# Altium schematic sheet ADC-TopSheet.SchDoc: <SPECIFIC SHEET FUNCTION>
size A3; Date: DO NOT USE, RATHER USE PROJ OPTIONS; DrawnBy: DO NOT USE, RATHER USE PROJ OPTIONS; Engineer: DO NOT USE, RATHER USE PROJ OPTIONS; Organization: DO NOT USE, RATHER USE PROJ OPTIONS; DocumentNumber: 1; Revision: DO NOT USE, RATHER USE PROJ OPTIONS; SheetNumber: 1; SheetTotal: 12; SCH_Sheet_Filename: <Filename.SchDoc>; CurrentTime: DO NOT USE, RATHER USE PROJ OPTIONS; Time: DO NOT USE, RATHER USE PROJ OPTIONS; DocumentFullPathAndName: DO NOT USE, RATHER USE PROJ OPTIONS; DocumentName: DO NOT USE, RATHER USE PROJ OPTIONS; ModifiedDate: DO NOT USE, RATHER USE PROJ OPTIONS; ImagePath: DO NOT USE, RATHER USE PROJ OPTIONS
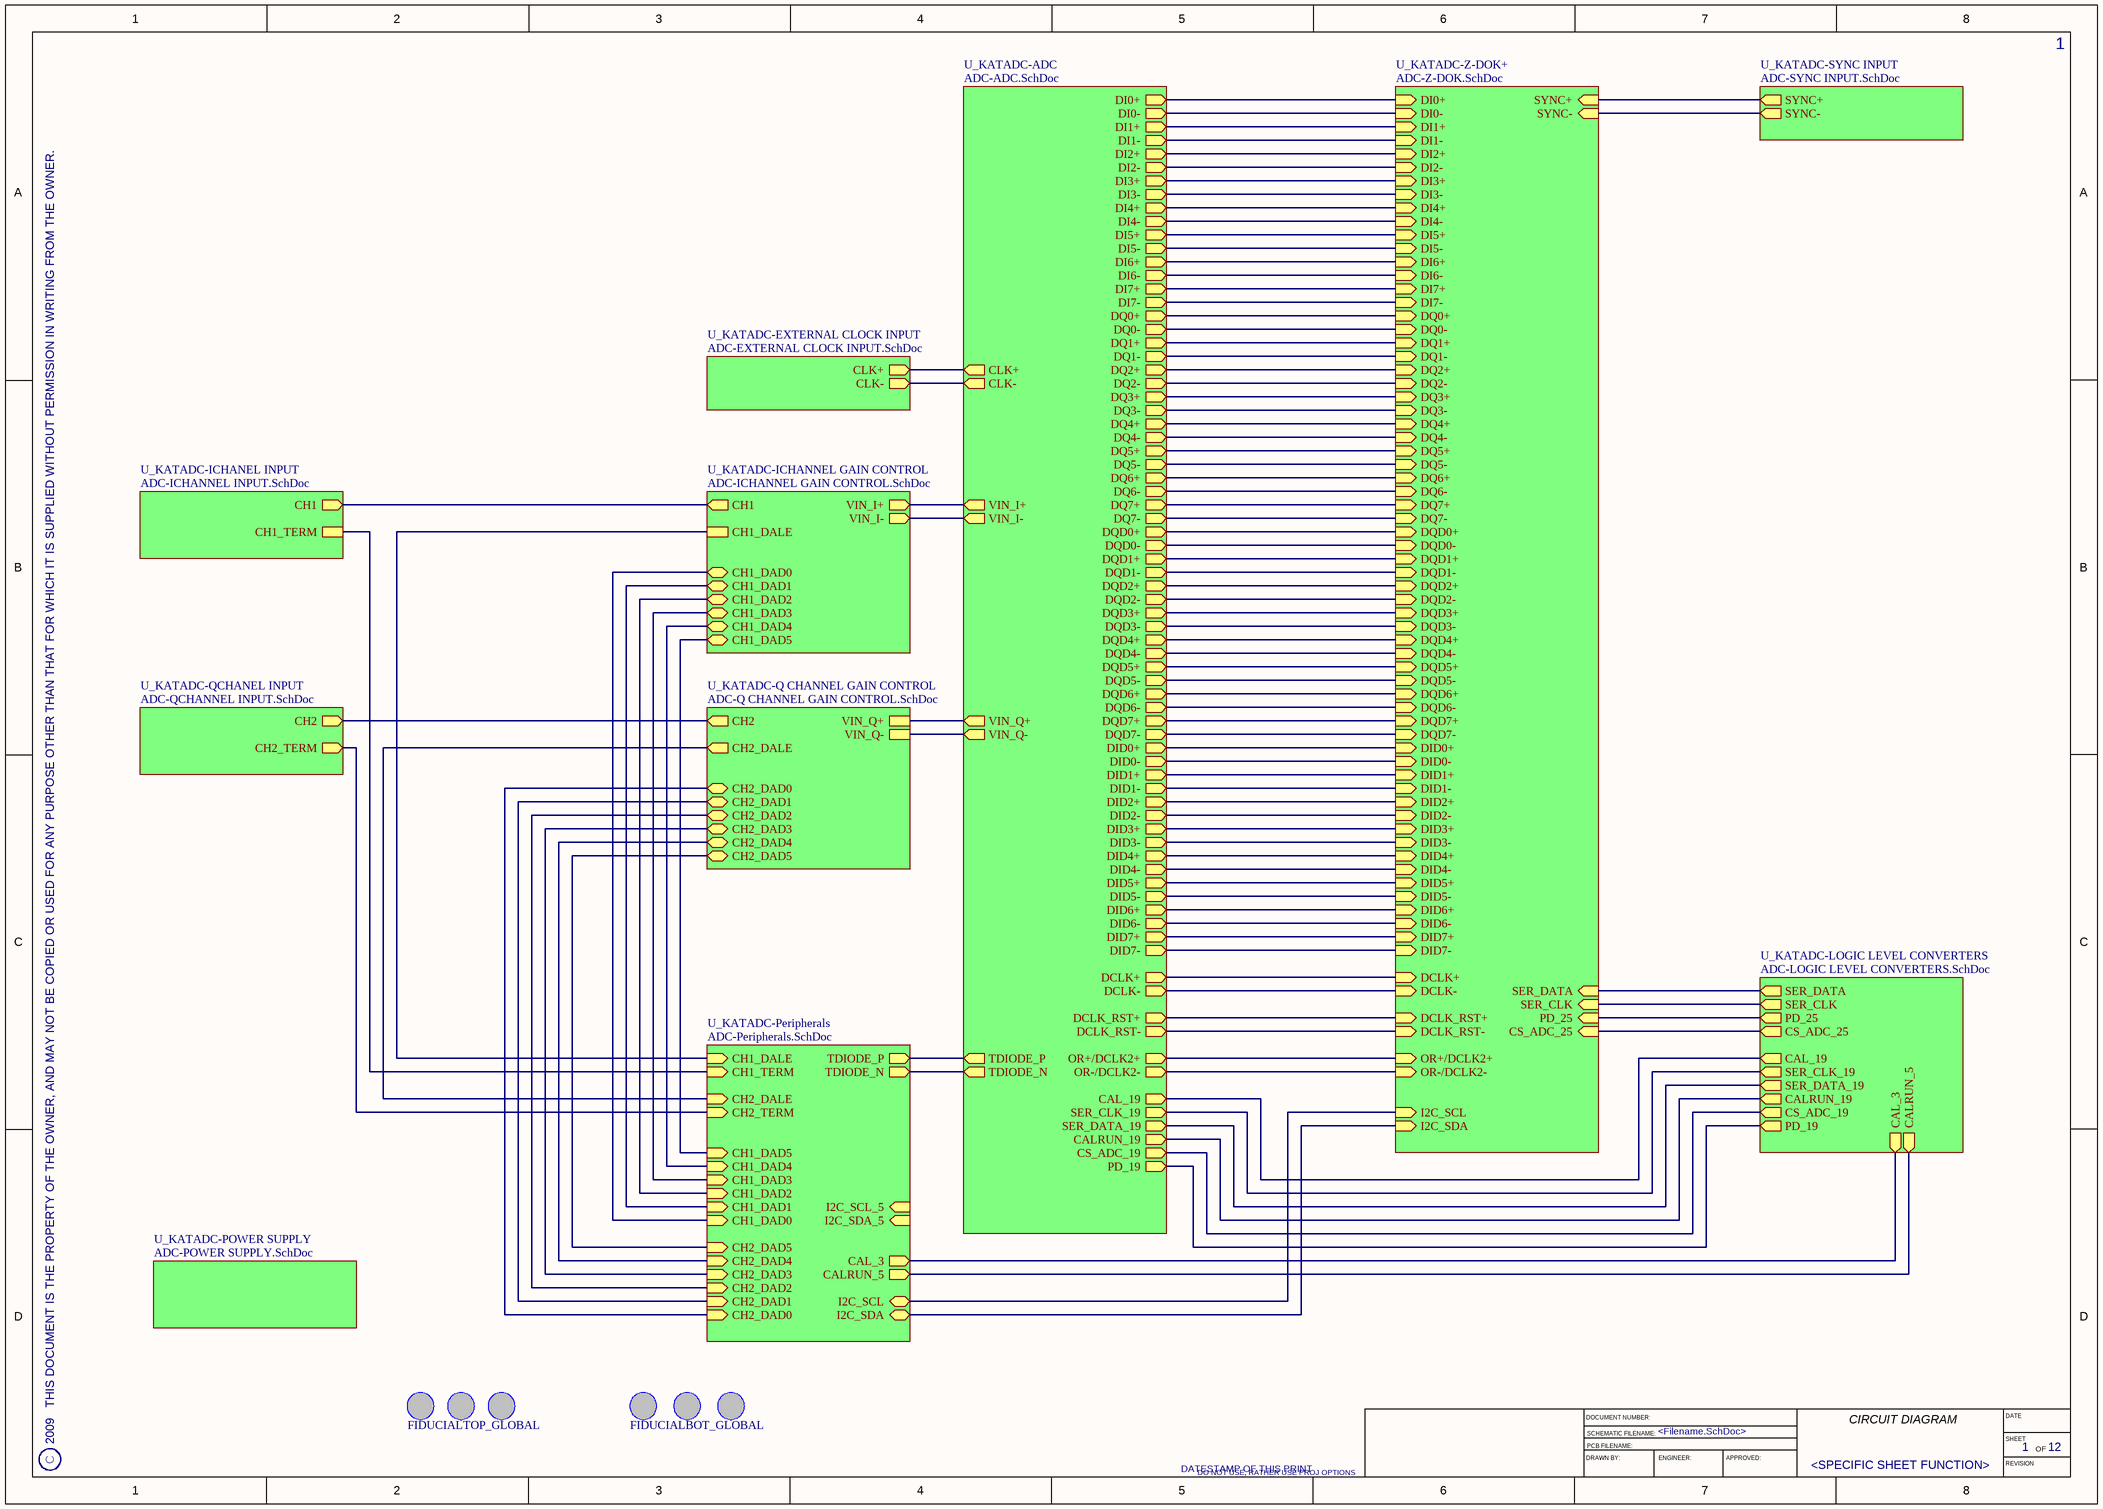
[diagram p0: ADC-TopSheet.SchDoc]

## Parts
F1  FIDUCIALTOP_GLOBAL  [FiducialTop_Global]
F2  FIDUCIALTOP_GLOBAL  [FiducialTop_Global]  (value not drawn)
F3  FIDUCIALTOP_GLOBAL  [FiducialTop_Global]  (value not drawn)
F6  FIDUCIALBOT_GLOBAL  [FiducialBot_Global]
F7  FIDUCIALBOT_GLOBAL  [FiducialBot_Global]  (value not drawn)
F8  FIDUCIALBOT_GLOBAL  [FiducialBot_Global]  (value not drawn)

## Sub-sheets
U_KATADC-ADC = ADC-ADC.SchDoc: DI0+ (out), DI0- (out), DI1+ (out), DI1- (out), DI2+ (out), DI2- (out), DI3+ (out), DI3- (out), DI4+ (out), DI4- (out), DI5+ (out), DI5- (out), DI6+ (out), DI6- (out), DI7+ (out), DI7- (out), DQ0+ (out), DQ0- (out), DQ1+ (out), DQ1- (out), DQ2+ (out), DQ2- (out), DQ3+ (out), DQ3- (out), DQ4+ (out), DQ4- (out), DQ5+ (out), DQ5- (out), DQ6+ (out), DQ6- (out), DQ7+ (out), DQ7- (out), DQD0+ (out), DQD0- (out), DQD1+ (out), DQD1- (out), DQD2+ (out), DQD2- (out), DQD3+ (out), DQD3- (out), DQD4+ (out), DQD4- (out), DQD5+ (out), DQD5- (out), DQD6+ (out), DQD6- (out), DQD7+ (out), DQD7- (out), DID0+ (out), DID0- (out), DID1+ (out), DID1- (out), DID2+ (out), DID2- (out), DID3+ (out), DID3- (out), DID4+ (out), DID4- (out), DID5+ (out), DID5- (out), DID6+ (out), DID6- (out), DID7+ (out), DID7- (out), TDIODE_P (out), TDIODE_N (out), VIN_I+ (out), VIN_I- (out), VIN_Q+ (out), VIN_Q- (out), PD_19 (out), DCLK_RST- (out), SER_CLK_19 (out), CLK+ (out), CLK- (out), SER_DATA_19 (out), DCLK_RST+ (out), CAL_19 (out), CS_ADC_19 (out), CALRUN_19 (out), OR+/DCLK2+ (out), OR-/DCLK2- (out), DCLK+ (out), DCLK- (out)
U_KATADC-EXTERNAL CLOCK INPUT = ADC-EXTERNAL CLOCK INPUT.SchDoc: CLK+ (out), CLK- (out)
U_KATADC-ICHANEL INPUT = ADC-ICHANNEL INPUT.SchDoc: CH1 (out), CH1_TERM
U_KATADC-ICHANNEL GAIN CONTROL = ADC-ICHANNEL GAIN CONTROL.SchDoc: VIN_I+ (out), VIN_I- (out), CH1 (out), CH1_DALE, CH1_DAD0, CH1_DAD1, CH1_DAD2, CH1_DAD3, CH1_DAD4, CH1_DAD5
U_KATADC-LOGIC LEVEL CONVERTERS = ADC-LOGIC LEVEL CONVERTERS.SchDoc: SER_DATA (out), SER_CLK (out), SER_DATA_19 (out), SER_CLK_19 (out), CALRUN_19 (out), CALRUN_5 (out), CAL_3 (out), CAL_19 (out), CS_ADC_25 (out), PD_25 (out), CS_ADC_19 (out), PD_19 (out)
U_KATADC-Peripherals = ADC-Peripherals.SchDoc: I2C_SDA_5 (in), I2C_SCL_5 (in), CH2_DAD0 (in), CH2_DAD1 (in), CH2_DAD2 (in), CH2_DAD3 (in), CH2_DAD4 (in), CH2_DAD5 (in), CH2_DALE (in), CH2_TERM (in), CAL_3 (out), CH1_DAD0 (in), CH1_DAD1 (in), CH1_DAD2 (in), CH1_DAD3 (in), CH1_DAD4 (in), CH1_DAD5 (in), CH1_DALE (in), CH1_TERM (in), CALRUN_5 (out), TDIODE_P (out), TDIODE_N (out), I2C_SDA, I2C_SCL
U_KATADC-POWER SUPPLY = ADC-POWER SUPPLY.SchDoc: no entries
U_KATADC-Q CHANNEL GAIN CONTROL = ADC-Q CHANNEL GAIN CONTROL.SchDoc: VIN_Q+, VIN_Q-, CH2 (out), CH2_DALE (out), CH2_DAD0, CH2_DAD1, CH2_DAD2, CH2_DAD3, CH2_DAD4, CH2_DAD5
U_KATADC-QCHANEL INPUT = ADC-QCHANNEL INPUT.SchDoc: CH2 (out), CH2_TERM (out)
U_KATADC-SYNC INPUT = ADC-SYNC INPUT.SchDoc: SYNC+ (out), SYNC- (out)
U_KATADC-Z-DOK+ = ADC-Z-DOK.SchDoc: SER_CLK (in), DID1+ (in), DID1- (in), DID4+ (in), DI0+ (in), DI0- (in), DI4- (in), DCLK_RST+ (in), DCLK_RST- (in), DQ4+ (in), DQ4- (in), DQ0+ (in), DI4+ (in), DQ0- (in), DQD4+ (in), DQD4- (in), DQD0+ (in), DQD0- (in), DID4- (in), SER_DATA (in), DID0+ (in), DID0- (in), DID3+ (in), DID7+ (in), DID7- (in), DI3- (in), DI7+ (in), DI7- (in), DQ5+ (in), DQ5- (in), DQ1+ (in), DI3+ (in), DQ1- (in), DQD5+ (in), DQD5- (in), DQD1+ (in), DQD1- (in), DID3- (in), I2C_SDA (in), OR-/DCLK2- (in), OR+/DCLK2+ (in), DQD3- (in), DQD3+ (in), DQD7- (in), DQD7+ (in), DQ3- (in), CS_ADC_25 (in), I2C_SCL (in), SYNC+ (in), SYNC- (in), DID5+ (in), DID5- (in), DI1+ (in), DI1- (in), DI5+ (in), DI5- (in), DQ7+ (in), DQ7- (in), DQ3+ (in), DCLK- (in), DCLK+ (in), DQD2- (in), DQD2+ (in), DQD6- (in), DQD6+ (in), DQ2- (in), PD_25 (in), DID2+ (in), DID2- (in), DID6+ (in), DID6- (in), DI2+ (in), DI2- (in), DI6+ (in), DI6- (in), DQ6+ (in), DQ6- (in), DQ2+ (in)

## Nets
(unnamed): sheet U_KATADC-EXTERNAL CLOCK INPUT/CLK+, sheet U_KATADC-ADC/CLK+
(unnamed): sheet U_KATADC-EXTERNAL CLOCK INPUT/CLK-, sheet U_KATADC-ADC/CLK-
(unnamed): sheet U_KATADC-ICHANEL INPUT/CH1, sheet U_KATADC-ICHANNEL GAIN CONTROL/CH1
(unnamed): sheet U_KATADC-ICHANEL INPUT/CH1_TERM, sheet U_KATADC-Peripherals/CH1_TERM
(unnamed): sheet U_KATADC-ICHANNEL GAIN CONTROL/VIN_I+, sheet U_KATADC-ADC/VIN_I+
(unnamed): sheet U_KATADC-ICHANNEL GAIN CONTROL/VIN_I-, sheet U_KATADC-ADC/VIN_I-
(unnamed): sheet U_KATADC-ICHANNEL GAIN CONTROL/CH1_DALE, sheet U_KATADC-Peripherals/CH1_DALE
(unnamed): sheet U_KATADC-ICHANNEL GAIN CONTROL/CH1_DAD0, sheet U_KATADC-Peripherals/CH1_DAD0
(unnamed): sheet U_KATADC-ICHANNEL GAIN CONTROL/CH1_DAD1, sheet U_KATADC-Peripherals/CH1_DAD1
(unnamed): sheet U_KATADC-ICHANNEL GAIN CONTROL/CH1_DAD2, sheet U_KATADC-Peripherals/CH1_DAD2
(unnamed): sheet U_KATADC-ICHANNEL GAIN CONTROL/CH1_DAD3, sheet U_KATADC-Peripherals/CH1_DAD3
(unnamed): sheet U_KATADC-ICHANNEL GAIN CONTROL/CH1_DAD4, sheet U_KATADC-Peripherals/CH1_DAD4
(unnamed): sheet U_KATADC-ICHANNEL GAIN CONTROL/CH1_DAD5, sheet U_KATADC-Peripherals/CH1_DAD5
(unnamed): sheet U_KATADC-LOGIC LEVEL CONVERTERS/SER_DATA, sheet U_KATADC-Z-DOK+/SER_DATA
(unnamed): sheet U_KATADC-LOGIC LEVEL CONVERTERS/SER_CLK, sheet U_KATADC-Z-DOK+/SER_CLK
(unnamed): sheet U_KATADC-LOGIC LEVEL CONVERTERS/SER_DATA_19, sheet U_KATADC-ADC/SER_DATA_19
(unnamed): sheet U_KATADC-LOGIC LEVEL CONVERTERS/SER_CLK_19, sheet U_KATADC-ADC/SER_CLK_19
(unnamed): sheet U_KATADC-LOGIC LEVEL CONVERTERS/CALRUN_19, sheet U_KATADC-ADC/CALRUN_19
(unnamed): sheet U_KATADC-LOGIC LEVEL CONVERTERS/CALRUN_5, sheet U_KATADC-Peripherals/CALRUN_5
(unnamed): sheet U_KATADC-LOGIC LEVEL CONVERTERS/CAL_3, sheet U_KATADC-Peripherals/CAL_3
(unnamed): sheet U_KATADC-LOGIC LEVEL CONVERTERS/CAL_19, sheet U_KATADC-ADC/CAL_19
(unnamed): sheet U_KATADC-LOGIC LEVEL CONVERTERS/CS_ADC_25, sheet U_KATADC-Z-DOK+/CS_ADC_25
(unnamed): sheet U_KATADC-LOGIC LEVEL CONVERTERS/PD_25, sheet U_KATADC-Z-DOK+/PD_25
(unnamed): sheet U_KATADC-LOGIC LEVEL CONVERTERS/CS_ADC_19, sheet U_KATADC-ADC/CS_ADC_19
(unnamed): sheet U_KATADC-LOGIC LEVEL CONVERTERS/PD_19, sheet U_KATADC-ADC/PD_19
(unnamed): sheet U_KATADC-Peripherals/CH2_DAD0, sheet U_KATADC-Q CHANNEL GAIN CONTROL/CH2_DAD0
(unnamed): sheet U_KATADC-Peripherals/CH2_DAD1, sheet U_KATADC-Q CHANNEL GAIN CONTROL/CH2_DAD1
(unnamed): sheet U_KATADC-Peripherals/CH2_DAD2, sheet U_KATADC-Q CHANNEL GAIN CONTROL/CH2_DAD2
(unnamed): sheet U_KATADC-Peripherals/CH2_DAD3, sheet U_KATADC-Q CHANNEL GAIN CONTROL/CH2_DAD3
(unnamed): sheet U_KATADC-Peripherals/CH2_DAD4, sheet U_KATADC-Q CHANNEL GAIN CONTROL/CH2_DAD4
(unnamed): sheet U_KATADC-Peripherals/CH2_DAD5, sheet U_KATADC-Q CHANNEL GAIN CONTROL/CH2_DAD5
(unnamed): sheet U_KATADC-Peripherals/CH2_DALE, sheet U_KATADC-Q CHANNEL GAIN CONTROL/CH2_DALE
(unnamed): sheet U_KATADC-Peripherals/CH2_TERM, sheet U_KATADC-QCHANEL INPUT/CH2_TERM
(unnamed): sheet U_KATADC-Peripherals/TDIODE_P, sheet U_KATADC-ADC/TDIODE_P
(unnamed): sheet U_KATADC-Peripherals/TDIODE_N, sheet U_KATADC-ADC/TDIODE_N
(unnamed): sheet U_KATADC-Peripherals/I2C_SDA, sheet U_KATADC-Z-DOK+/I2C_SDA
(unnamed): sheet U_KATADC-Peripherals/I2C_SCL, sheet U_KATADC-Z-DOK+/I2C_SCL
(unnamed): sheet U_KATADC-QCHANEL INPUT/CH2, sheet U_KATADC-Q CHANNEL GAIN CONTROL/CH2
(unnamed): sheet U_KATADC-Q CHANNEL GAIN CONTROL/VIN_Q+, sheet U_KATADC-ADC/VIN_Q+
(unnamed): sheet U_KATADC-Q CHANNEL GAIN CONTROL/VIN_Q-, sheet U_KATADC-ADC/VIN_Q-
(unnamed): sheet U_KATADC-SYNC INPUT/SYNC+, sheet U_KATADC-Z-DOK+/SYNC+
(unnamed): sheet U_KATADC-SYNC INPUT/SYNC-, sheet U_KATADC-Z-DOK+/SYNC-
(unnamed): sheet U_KATADC-Z-DOK+/DID1+, sheet U_KATADC-ADC/DID1+
(unnamed): sheet U_KATADC-Z-DOK+/DID1-, sheet U_KATADC-ADC/DID1-
(unnamed): sheet U_KATADC-Z-DOK+/DID4+, sheet U_KATADC-ADC/DID4+
(unnamed): sheet U_KATADC-Z-DOK+/DI0+, sheet U_KATADC-ADC/DI0+
(unnamed): sheet U_KATADC-Z-DOK+/DI0-, sheet U_KATADC-ADC/DI0-
(unnamed): sheet U_KATADC-Z-DOK+/DI4-, sheet U_KATADC-ADC/DI4-
(unnamed): sheet U_KATADC-Z-DOK+/DCLK_RST+, sheet U_KATADC-ADC/DCLK_RST+
(unnamed): sheet U_KATADC-Z-DOK+/DCLK_RST-, sheet U_KATADC-ADC/DCLK_RST-
(unnamed): sheet U_KATADC-Z-DOK+/DQ4+, sheet U_KATADC-ADC/DQ4+
(unnamed): sheet U_KATADC-Z-DOK+/DQ4-, sheet U_KATADC-ADC/DQ4-
(unnamed): sheet U_KATADC-Z-DOK+/DQ0+, sheet U_KATADC-ADC/DQ0+
(unnamed): sheet U_KATADC-Z-DOK+/DI4+, sheet U_KATADC-ADC/DI4+
(unnamed): sheet U_KATADC-Z-DOK+/DQ0-, sheet U_KATADC-ADC/DQ0-
(unnamed): sheet U_KATADC-Z-DOK+/DQD4+, sheet U_KATADC-ADC/DQD4+
(unnamed): sheet U_KATADC-Z-DOK+/DQD4-, sheet U_KATADC-ADC/DQD4-
(unnamed): sheet U_KATADC-Z-DOK+/DQD0+, sheet U_KATADC-ADC/DQD0+
(unnamed): sheet U_KATADC-Z-DOK+/DQD0-, sheet U_KATADC-ADC/DQD0-
(unnamed): sheet U_KATADC-Z-DOK+/DID4-, sheet U_KATADC-ADC/DID4-
(unnamed): sheet U_KATADC-Z-DOK+/DID0+, sheet U_KATADC-ADC/DID0+
(unnamed): sheet U_KATADC-Z-DOK+/DID0-, sheet U_KATADC-ADC/DID0-
(unnamed): sheet U_KATADC-Z-DOK+/DID3+, sheet U_KATADC-ADC/DID3+
(unnamed): sheet U_KATADC-Z-DOK+/DID7+, sheet U_KATADC-ADC/DID7+
(unnamed): sheet U_KATADC-Z-DOK+/DID7-, sheet U_KATADC-ADC/DID7-
(unnamed): sheet U_KATADC-Z-DOK+/DI3-, sheet U_KATADC-ADC/DI3-
(unnamed): sheet U_KATADC-Z-DOK+/DI7+, sheet U_KATADC-ADC/DI7+
(unnamed): sheet U_KATADC-Z-DOK+/DI7-, sheet U_KATADC-ADC/DI7-
(unnamed): sheet U_KATADC-Z-DOK+/DQ5+, sheet U_KATADC-ADC/DQ5+
(unnamed): sheet U_KATADC-Z-DOK+/DQ5-, sheet U_KATADC-ADC/DQ5-
(unnamed): sheet U_KATADC-Z-DOK+/DQ1+, sheet U_KATADC-ADC/DQ1+
(unnamed): sheet U_KATADC-Z-DOK+/DI3+, sheet U_KATADC-ADC/DI3+
(unnamed): sheet U_KATADC-Z-DOK+/DQ1-, sheet U_KATADC-ADC/DQ1-
(unnamed): sheet U_KATADC-Z-DOK+/DQD5+, sheet U_KATADC-ADC/DQD5+
(unnamed): sheet U_KATADC-Z-DOK+/DQD5-, sheet U_KATADC-ADC/DQD5-
(unnamed): sheet U_KATADC-Z-DOK+/DQD1+, sheet U_KATADC-ADC/DQD1+
(unnamed): sheet U_KATADC-Z-DOK+/DQD1-, sheet U_KATADC-ADC/DQD1-
(unnamed): sheet U_KATADC-Z-DOK+/DID3-, sheet U_KATADC-ADC/DID3-
(unnamed): sheet U_KATADC-Z-DOK+/OR-/DCLK2-, sheet U_KATADC-ADC/OR-/DCLK2-
(unnamed): sheet U_KATADC-Z-DOK+/OR+/DCLK2+, sheet U_KATADC-ADC/OR+/DCLK2+
(unnamed): sheet U_KATADC-Z-DOK+/DQD3-, sheet U_KATADC-ADC/DQD3-
(unnamed): sheet U_KATADC-Z-DOK+/DQD3+, sheet U_KATADC-ADC/DQD3+
(unnamed): sheet U_KATADC-Z-DOK+/DQD7-, sheet U_KATADC-ADC/DQD7-
(unnamed): sheet U_KATADC-Z-DOK+/DQD7+, sheet U_KATADC-ADC/DQD7+
(unnamed): sheet U_KATADC-Z-DOK+/DQ3-, sheet U_KATADC-ADC/DQ3-
(unnamed): sheet U_KATADC-Z-DOK+/DID5+, sheet U_KATADC-ADC/DID5+
(unnamed): sheet U_KATADC-Z-DOK+/DID5-, sheet U_KATADC-ADC/DID5-
(unnamed): sheet U_KATADC-Z-DOK+/DI1+, sheet U_KATADC-ADC/DI1+
(unnamed): sheet U_KATADC-Z-DOK+/DI1-, sheet U_KATADC-ADC/DI1-
(unnamed): sheet U_KATADC-Z-DOK+/DI5+, sheet U_KATADC-ADC/DI5+
(unnamed): sheet U_KATADC-Z-DOK+/DI5-, sheet U_KATADC-ADC/DI5-
(unnamed): sheet U_KATADC-Z-DOK+/DQ7+, sheet U_KATADC-ADC/DQ7+
(unnamed): sheet U_KATADC-Z-DOK+/DQ7-, sheet U_KATADC-ADC/DQ7-
(unnamed): sheet U_KATADC-Z-DOK+/DQ3+, sheet U_KATADC-ADC/DQ3+
(unnamed): sheet U_KATADC-Z-DOK+/DCLK-, sheet U_KATADC-ADC/DCLK-
(unnamed): sheet U_KATADC-Z-DOK+/DCLK+, sheet U_KATADC-ADC/DCLK+
(unnamed): sheet U_KATADC-Z-DOK+/DQD2-, sheet U_KATADC-ADC/DQD2-
(unnamed): sheet U_KATADC-Z-DOK+/DQD2+, sheet U_KATADC-ADC/DQD2+
(unnamed): sheet U_KATADC-Z-DOK+/DQD6-, sheet U_KATADC-ADC/DQD6-
(unnamed): sheet U_KATADC-Z-DOK+/DQD6+, sheet U_KATADC-ADC/DQD6+
(unnamed): sheet U_KATADC-Z-DOK+/DQ2-, sheet U_KATADC-ADC/DQ2-
(unnamed): sheet U_KATADC-Z-DOK+/DID2+, sheet U_KATADC-ADC/DID2+
(unnamed): sheet U_KATADC-Z-DOK+/DID2-, sheet U_KATADC-ADC/DID2-
(unnamed): sheet U_KATADC-Z-DOK+/DID6+, sheet U_KATADC-ADC/DID6+
(unnamed): sheet U_KATADC-Z-DOK+/DID6-, sheet U_KATADC-ADC/DID6-
(unnamed): sheet U_KATADC-Z-DOK+/DI2+, sheet U_KATADC-ADC/DI2+
(unnamed): sheet U_KATADC-Z-DOK+/DI2-, sheet U_KATADC-ADC/DI2-
(unnamed): sheet U_KATADC-Z-DOK+/DI6+, sheet U_KATADC-ADC/DI6+
(unnamed): sheet U_KATADC-Z-DOK+/DI6-, sheet U_KATADC-ADC/DI6-
(unnamed): sheet U_KATADC-Z-DOK+/DQ6+, sheet U_KATADC-ADC/DQ6+
(unnamed): sheet U_KATADC-Z-DOK+/DQ6-, sheet U_KATADC-ADC/DQ6-
(unnamed): sheet U_KATADC-Z-DOK+/DQ2+, sheet U_KATADC-ADC/DQ2+

## Notes on the sheet
- 2009   THIS DOCUMENT IS THE PROPERTY OF THE OWNER, AND MAY NOT BE COPIED OR USED FOR ANY PURPOSE OTHER THAN THAT FOR WHICH IT IS SUPPLIED WITHOUT PERMISSION IN WRITING FROM THE OWNER.
- C
- DATESTAMP OF THIS PRINT
- DRAWN BY:
- DOCUMENT NUMBER:
- SCHEMATIC FILENAME:
- PCB FILENAME:
- ENGINEER:
- APPROVED:
- CIRCUIT DIAGRAM
- DATE
- SHEET
- REVISION
- OF

## Library data of the parts
F1-F3 = FIDUCIALTOP_GLOBAL: Value: ????; Manufacturer: *; Manufacturer_PN: *; Created_By: *; Checked_By: *; Checked_Date: *; HelpURL: *; ComponentLink1Description: Footprint Detail; ComponentLink1URL: *; ComponentLink2Description: Application Note; ComponentLink2URL: *; ComponentLink3Description: Layout Guidelines; ComponentLink3URL: *; ComponentLink4Description: Technology Reference; ComponentLink4URL: *; Supplier1: *; Supplier2: *; Unit_Cost: *; MOQ: *; Leadtime: *; Inventory_Stock: *; Tolerance: *; Wattage: *; Voltage: *; Package: *; ComponentLink5Description: Production Detail; ComponentLink5URL: *; Note: *; Stock Code: *
F6-F8 = FIDUCIALBOT_GLOBAL: Value: ????; Manufacturer: *; Manufacturer_PN: *; Created_By: *; Checked_By: *; Checked_Date: *; HelpURL: *; ComponentLink1Description: Footprint Detail; ComponentLink1URL: *; ComponentLink2Description: Application Note; ComponentLink2URL: *; ComponentLink3Description: Layout Guidelines; ComponentLink3URL: *; ComponentLink4Description: Technology Reference; ComponentLink4URL: *; Supplier1: *; Supplier2: *; Unit_Cost: *; MOQ: *; Leadtime: *; Inventory_Stock: *; Tolerance: *; Wattage: *; Voltage: *; Package: *; ComponentLink5Description: Production Detail; ComponentLink5URL: *; Note: *; Stock Code: *